# Altium schematic sheet CKT_C70005-A2.SchDoc
size 330 x 219 mm; PageSetup: Record=PageOptions|CenterHorizontal=True|CenterVertical=True|PrintScale=0.89|XCorrection=1.00|YCorrection=1.00|PrintKind=0|BorderSize=5000000|LeftOffset=0|BottomOffset=0|Orientation=2|PaperLength=1000|PaperWidth=1000|Scale=100|PaperSource=7|PrintQuality=-3|MediaType=1|DitherType=10|PaperKind=A4|PrintScaleMode=1
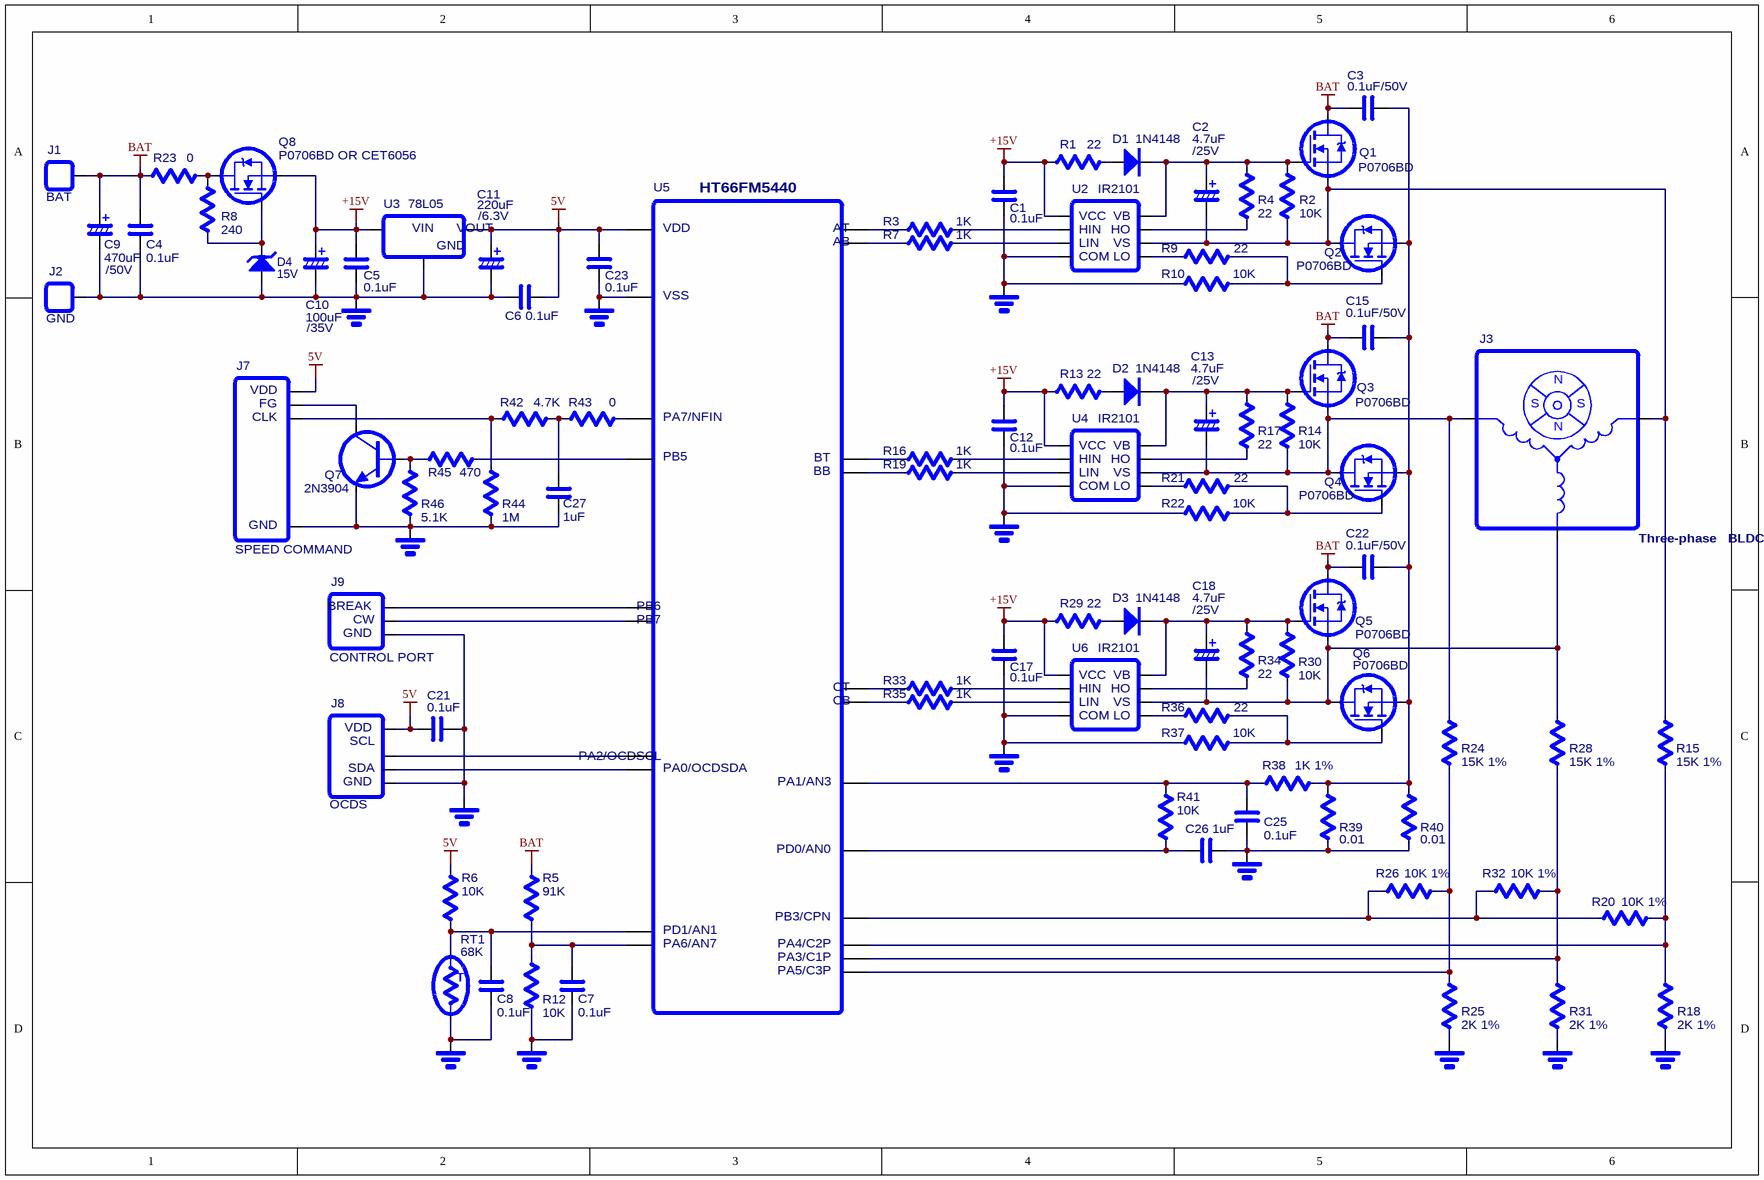
[diagram p0: CKT_C70005-A2.SchDoc]

## Parts
(Parts that share a designator on the sheet are numbered #1, #2 ... from top to bottom, then left to right.)
*#1  GND(1)  (value not drawn)
*#2  GND(1)  (value not drawn)
*#3  GND(1)  (value not drawn)
*#4  GND(1)  (value not drawn)
*#5  GND(1)  (value not drawn)
*#6  GND(1)  (value not drawn)
*#7  GND(1)  (value not drawn)
*#8  GND(1)  (value not drawn)
*#9  GND(1)  (value not drawn)
*#10  GND(1)  (value not drawn)
*#11  GND(1)  (value not drawn)
*#12  GND(1)  (value not drawn)
*#13  GND(1)  (value not drawn)
C1  0.1uF
C2  4.7uF
C3  0.1uF/50V
C4  0.1uF
C5  0.1uF
C6  0.1uF
C7  0.1uF
C8  0.1uF
C9  470uF
C10  100uF
C11  220uF
C12  0.1uF
C13  4.7uF
C15  0.1uF/50V
C17  0.1uF
C18  4.7uF
C21  0.1uF
C22  0.1uF/50V
C23  0.1uF
C25  0.1uF
C26  1uF
C27  1uF
D1  1N4148  [SMC]
D2  1N4148  [SMC]
D3  1N4148  [SMC]
D4  15V  [SOT-23]
J1  BAT  [HDR1X4H]
J2  GND  [HDR1X4H]
J3  BLDC motor(1)  (value not drawn)
J7  SPEED COMMAND  [HDR1X4H]
J8  OCDS  [HDR1X4H]
J9  CONTROL PORT  [HDR1X4H]
Q1  P0706BD  [TO-220AB]
Q2  P0706BD  [TO-220AB]
Q3  P0706BD  [TO-220AB]
Q4  P0706BD  [TO-220AB]
Q5  P0706BD  [TO-220AB]
Q6  P0706BD  [TO-220AB]
Q7  2N3904  [TO-226-AA]
Q8  P0706BD OR CET6056  [TO-220AB]
R1  22
R2  10K
R3  1K
R4  22
R5  91K
R6  10K
R7  1K
R8  240
R9  22
R10  10K
R12  10K
R13  22
R14  10K
R15  15K 1%
R16  1K
R17  22
R18  2K 1%
R19  1K
R20  10K 1%
R21  22
R22  10K
R23  0
R24  15K 1%
R25  2K 1%
R26  10K 1%
R28  15K 1%
R29  22
R30  10K
R31  2K 1%
R32  10K 1%
R33  1K
R34  22
R35  1K
R36  22
R37  10K
R38  1K 1%
R39  0.01
R40  0.01
R41  10K
R42  4.7K
R43  0
R44  1M
R45  470
R46  5.1K
RT1  68K
U2  IR2101
U3  78L05  [SOT23-5]
U4  IR2101
U5  HT66FM5440/28SSOP  (value not drawn)
U6  IR2101

## Nets
5V: C6.1 C11.1 C21.1 C23.1 J7.1 J8.1 R6.2 U3.3(Vout) U5.19
+15V: C1.2 C5.2 C10.1 C12.2 C17.2 Q8.3 R1.1 R13.1 R29.1 U2.19 U3.2(Vin) U4.19 U6.19
BAT: C3.2 C4.2 C9.1 C15.2 C22.2 J1.1 Q1.2(D) Q3.2(D) Q5.2(D) R5.2 R23.2
Net*#1_?1: *#1.?1 C1.1 R10.2 U2.24
Net*#2_?1: *#2.?1 C4.1 C5.1 C6.2 C9.2 C10.2 C11.2 D4.1(A) J2.1 U3.1(GND)
Net*#3_?1: *#3.?1 C23.2 U5.20
Net*#4_?1: *#4.?1 C12.1 R22.2 U4.24
Net*#5_?1: *#5.?1 C27.1 J7.4(GND) Q7.3(E) R44.1 R46.1
Net*#6_?1: *#6.?1 C17.1 R37.2 U6.24
Net*#7_?1: *#7.?1 C21.2 J8.4(GND) J9.4(GND)
Net*#8_?1: *#8.?1 C25.2 C26.1 R39.2 R40.2
Net*#9_?1: *#9.?1 C8.1 RT1.2
Net*#10_?1: *#10.?1 C7.1 R12.1
Net*#11_?1: *#11.?1 R25.2
Net*#12_?1: *#12.?1 R31.2
Net*#13_?1: *#13.?1 R18.2
NetC2_1: C2.1 D1.2(K) Q1.1(G) R2.2 R4.2 U2.24
NetC2_2: C2.2 J3.W Q1.3 Q2.2(D) R2.1 R15.1 U2.20
NetC3_1: C3.1 C15.1 C22.1 Q2.3 Q4.3 Q6.3 R38.1 R39.1 R40.1
NetC7_2: C7.2 R5.1 R12.2 U5.18
NetC8_2: C8.2 R6.1 RT1.1 U5.22
NetC13_1: C13.1 D2.2(K) Q3.1(G) R14.2 R17.2 U4.24
NetC13_2: C13.2 J3.U Q3.3 Q4.2(D) R14.1 R24.1 U4.20
NetC18_1: C18.1 D3.2(K) Q5.1(G) R30.2 R34.2 U6.24
NetC18_2: C18.2 J3.V Q5.3 Q6.2(D) R28.1 R30.1 U6.20
NetC25_1: C25.1 R38.2 R41.2 U5.21
NetC26_2: C26.2 R41.1 U5.24(GND)
NetC27_2: C27.2 R42.1 R43.2
NetD1_1: D1.1(A) R1.2
NetD2_1: D2.1(A) R13.2
NetD3_1: D3.1(A) R29.2
NetD4_2: D4.2(K) Q8.1(G) R8.1
NetJ7_2: J7.2(CLK/VSP) R42.2 R44.2
NetJ7_3: J7.3(FG) Q7.1(C)
NetJ8_3: J8.3(FG) U5.12
NetJ8_3: J8.3(FG) U5.13  [a separate net that carries the same name]
NetJ9_1: J9.1 U5.12
NetJ9_3: J9.3(FG) U5.11
NetQ2_1: Q2.1(G) R9.2 R10.1
NetQ4_1: Q4.1(G) R21.2 R22.1
NetQ6_1: Q6.1(G) R36.2 R37.1
NetQ7_2: Q7.2(B) R45.2 R46.2
NetQ8_2: Q8.2(D) R8.2 R23.1
NetR3_1: R3.1 U5.5
NetR3_2: R3.2 U2.20
NetR4_1: R4.1 U2.23
NetR7_1: R7.1 U5.6
NetR7_2: R7.2 U2.23
NetR9_1: R9.1 U2.19
NetR15_2: R15.2 R18.1 R20.2 U5.8
NetR16_1: R16.1 U5.3
NetR16_2: R16.2 U4.20
NetR17_1: R17.1 U4.23
NetR19_1: R19.1 U5.4
NetR19_2: R19.2 U4.23
NetR20_1: R20.1 R26.1 R32.1 U5.10
NetR21_1: R21.1 U4.19
NetR24_2: R24.2 R25.1 R26.2 U5.9
NetR28_2: R28.2 R31.1 R32.2 U5.7
NetR33_1: R33.1 U5.2
NetR33_2: R33.2 U6.20
NetR34_1: R34.1 U6.23
NetR35_1: R35.1 U5.1(GND)
NetR35_2: R35.2 U6.23
NetR36_1: R36.1 U6.19
NetR43_1: R43.1 U5.23
NetR45_1: R45.1 U5.24

## Notes on the sheet
- /25V
- (near U3) /6.3V
- (near U5) HT66FM5440
- /50V
- (near *#2) /35V
- (in symbol 78L05_1) VIN; VOUT
- (in symbol BLDC motor(1)_1) N; S; Three-phase   BLDC motor
- (in symbol Header 4H_1) VDD; CLK
- (in symbol Header 4H_2) BREAK; CW
- (in symbol Header 4H_3) VDD; SCL; SDA
- (in symbol HT66FM5440/28SSOP) VDD; AT; AB; VSS; PA7/NFIN; PB5; BT; BB; PB6; PB7; CT; CB; PA2/OCDSCL; PA0/OCDSDA; PA1/AN3; PD0/AN0; PB3/CPN; PD1/AN1; PA6/AN7; PA4/C2P; PA3/C1P; PA5/C3P
- (in symbol IR2101/SOP-8) VCC; VB; HIN; HO; LIN; VS; COM; LO
- (in symbol Sensor(1)) T

## Library data of the parts
*#1-*#13 = GND(1): GND; Value: *; Update: 2016/12/29; Size: Small
C1 C3-C8 C12 C15 C17 C21-C23 C25-C27 = Cap(1): Capacitor; Published: 8-Jun-2000; LatestRevisionDate: 17-Jul-2002; LatestRevisionNote: Re-released for DXP Platform.; PackageReference: RAD-0.3; Publisher: Altium Limited; Size: Small; Update: 2016/12/29
  C1 C4-C8 C12 C17 C21 C23 C25: Value: 0.1uF
  C3 C15 C22: Value: 0.1uF/50V
  C26 C27: Value: 1uF
C2 C9-C11 C13 C18 = Cap(2): Capacitor; Update: 2016/12/29; Size: Small
  C2 C13 C18: Value: 4.7uF
  C9: Value: 470uF
  C10: Value: 100uF
  C11: Value: 220uF
D1-D3 = Diode(1): Diode; Published: 8-Jun-2000; LatestRevisionDate: 17-Jul-2002; LatestRevisionNote: Re-released for DXP Platform.; PackageVersion: Sep-1996; PackageReference: SMC; Publisher: Altium Limited; PackageDescription: DO-214-AB/SMC; 2 C-Bend Leads; Body 7.9 x 5.9 mm, inc. leads (LxW); Code_JEDEC: DO-214-AB; Value: 1N4148; Update: 2016/12/29; Size: Small
D4 = Zener(1): Zener Diode; Value: 15V; Update: *; Size: Small
J1 J2 = CON1: LatestRevisionDate: 17-Jul-2002; LatestRevisionNote: Re-released for DXP Platform.; Publisher: Altium Limited
J3 = BLDC motor(1)_1
J7 = Header 4H_1: Header, 4-Pin, Right Angle; LatestRevisionDate: 17-Jul-2002; LatestRevisionNote: Re-released for DXP Platform.; Publisher: Altium Limited
J8 = Header 4H_3: Header, 4-Pin, Right Angle; LatestRevisionDate: 17-Jul-2002; LatestRevisionNote: Re-released for DXP Platform.; Publisher: Altium Limited
J9 = Header 4H_2: Header, 4-Pin, Right Angle; LatestRevisionDate: 17-Jul-2002; LatestRevisionNote: Re-released for DXP Platform.; Publisher: Altium Limited
Q1-Q6 Q8 = NMOS(4): N-Channel Power MOSFET; Note: Pin 2 is electrically connected to pin 4.; Published: 8-Jun-2000; LatestRevisionDate: 17-Jul-2002; LatestRevisionNote: Re-released for DXP Platform.; DatasheetVersion: PD-9.814; PackageVersion: Feb-1997; PackageReference: TO-220AB; Publisher: Altium Limited; PackageDescription: TO, Thru-Hole, Vertical, Heatsink Mounted; 3 In-Line Leads; Pitch 2.54 mm; ComponentLink1Description: Manufacturer Link; ComponentLink1URL: http://www.irf.com/
Q7 = NPN(2): NPN Bipolar Transistor; Published: 8-Jun-2000; LatestRevisionDate: 17-Jul-2002; LatestRevisionNote: Re-released for DXP Platform.; PackageReference: TO-226-AA; Publisher: Altium Limited; PackageDescription: TO, Flat Index; 3 In-Line, Axial Leads; Body Dia. 4.8mm; Leads 0.55 x 0.51 mm (max); Code_JEDEC: TO-226-AA
R1-R10 R12-R26 R28-R46 = Resistor(1)_1: Resisitor; Size: Midium; Update: 2016/12/29
  R1 R4 R9 R13 R17 R21 R29 R34 R36: Value: 22
  R2 R6 R10 R12 R14 R22 R30 R37 R41: Value: 10K
  R3 R7 R16 R19 R33 R35: Value: 1K
  R5: Value: 91K
  R8: Value: 240
  R15 R24 R28: Value: 15K 1%
  R18 R25 R31: Value: 2K 1%
  R20 R26 R32: Value: 10K 1%
  R23 R43: Value: 0
  R38: Value: 1K 1%
  R39 R40: Value: 0.01
  R42: Value: 4.7K
  R44: Value: 1M
  R45: Value: 470
  R46: Value: 5.1K
RT1 = Sensor(1)
U2 U4 U6 = IR2101/SOP-8
U3 = 78L05_1